# Altium schematic sheet 3V3REG.SchDoc
size B; SheetNumber: 10; SheetTotal: 11
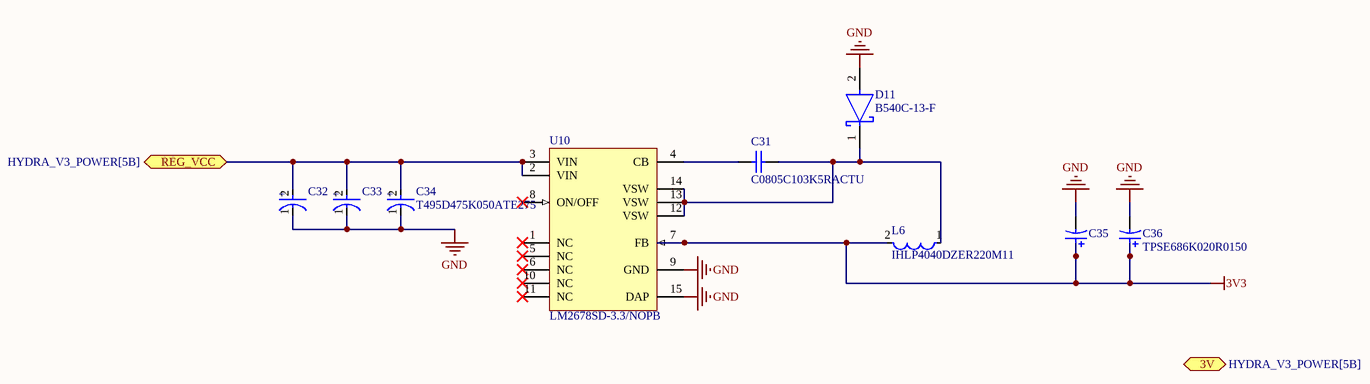
[diagram p0: 3V3REG.SchDoc]

## Parts
C31  C0805C103K5RACTU  [CAPC2013X88X50LL20T25]
C32  (no value)  [FP-T495D475K050ATE275-MFG]
C33  (no value)  [FP-T495D475K050ATE275-MFG]
C34  T495D475K050ATE275  [FP-T495D475K050ATE275-MFG]
C35  (no value)  [CAPMP7344X43-T_V]
C36  TPSE686K020R0150  [CAPMP7344X43-T_V]
D11  B540C-13-F  [FP-SMC-MFG]
L6  IHLP4040DZER220M11  [FP-IHLP-4040DZ-FP_3_124x3-MFG]
U10  LM2678SD-3.3/NOPB  [NHM0014A_V]

## Ports
3V (bidir, see HYDRA_V3_POWER[5B]), REG_VCC (bidir, see HYDRA_V3_POWER[5B])

## Nets
3V3: C35.1 C36.1 L6.2 U10.7(FB)
GND: C32.1(C) C33.1(C) C34.1(C) C35.2 C36.2 D11.2(A) U10.9(GND) U10.15(DAP)
REG_VCC: C32.2(A) C33.2(A) C34.2(A) U10.2(VIN) U10.3(VIN) ; port REG_VCC
NetC31_1: C31.1 U10.4(CB)
NetC31_2: C31.2 D11.1(C) L6.1 U10.12(VSW) U10.13(VSW) U10.14(VSW)

Not connected (* = marked no-connect by the designer): U10 1(NC)* 5(NC)* 6(NC)* 8(ON/OFF)* 10(NC)* 11(NC)*

## Notes on the sheet
- (in symbol CMP-03017-000055-1) +

## Library data of the parts
C31 = CMP-2007-00266-1: Manufacturer: Kemet; Part Number: C0805C103K5RACTU
C32-C34 = CMP-03017-000055-1: CAP TANT 4.7UF 10% 50V 2917; Life (Hours): 2000Hour; Polarity: Polar; Dissipation Factor: 6%; ESR (Equivalent Series Resistance): 275mR; Construction: Flat; Features: General Purpose; RoHS Compliant: Yes; Lead Free: Lead Free; Case Code (Imperial): 2917; Height - Seated (Max): 0.122inch; Termination: SMD/SMT; Number of Pins: 2; Packaging: Tape and Reel; Voltage Rating (DC): 50V; Case Code (Metric): 7343; Mount: Surface Mount; Radiation Hardening: No; Width: 0.169inch; Package Quantity: 1; Depth: 4.3mm; Voltage Rating: 50V; Tolerance: 10%; Max Operating Temperature: 125°C; Min Operating Temperature: -55°C; Length: 7.3mm; Capacitance: 4.7uF; REACH SVHC: No SVHC; Height: 3.1mm; Series: T495; Case/Package: 2917
C35 C36 = CMP-2000-07314-1: Low ESR, 68 uF, 20 V, +/- 10%, -55 to 125 degC, 2-Pin SMD, RoHS, Tape and Reel; Manufacturer: AVX; Wire Form: NotRequired; Product Diameter (mm): NotRequiredmm; Product Height (mm): 4.1mm; Rad Hardened: No; Voltage: 20VDC; DF: 6%; Product Depth (mm): 4.3mm; DCL: 13.6uA; Product Length (mm): 7.3mm; Capacitance: 68000000pF; DELETED: Compliant; ESR: 0.15ohm; Polarity: Polar; Case Style: Molded; Insulation: NotRequired; Construction: SMTChip; Mounting Technology: SurfaceMount; Failure Rate: NotRequired; Length W/Weld (max): NotRequiredmm; Package Reference: CAPMP7344X43-T; Seal: NotRequired; Tolerance (+ or -): 10%; Operating Temp Range: -55Cto125C; Seated Plane Height: NotRequiredmm; Package URL: http://www.avx.com/download/software/literature/AVX-Footprint-Library.pdf; Lead Spacing (nom): NotRequiredmm; Mounting Style: SurfaceMount; Case Code: E; Package Description: 2-Pin Surface Mount Device, Body 7.3 x 4.35 mm; Manufacturer URL: http://www.avx.com/; Package / Case: 7343-43; Packaging: TapeandReel; Datasheet Version: 01/2017; Length W/Weld: NotRequiredmm; Datasheet URL: http://datasheets.avx.com/TPS.pdf
D11 = CMP-2000-05097-3: DIODE SCHOTTKY 40V 5A SMC; Manufacturer: Diodes Inc.; Automotive Grade: NA; Peak Reverse Current: 0.5mA; Value: 300pF; Max Junction Temp: +150°C; Max Surge Forward Current: 100A; Standoff Height: 0.1mm; Digikey Description: DIODE SCHOTTKY 40V 5A SMC; Temperature Range Low: -55°C; Manufacturer Part Number: B540C-13-F; Octopart: https://octopart.com/b540c-13-f-diodes+inc.-325873; Lead Free: Yes; Reverse Voltage: 40V; RoHS: TRUE; Category: Diode; Mouser Description: Diode: Schottky rectifying; SMD; 40V; 5A; SMC; Package: reel, tape; ComponentLink2Description: Datasheet; Temperature Range High: +150°C; Automotive: No; Footprint Url: https://www.diodes.com/assets/Package-Files/SMC.pdf; Device Class L3: Schottky Diodes; Height: 2.5mm; Forward Current: 5A; Temperature: -55°C to +150°C; Package: SMC; ComponentLink2URL: https://www.diodes.com/assets/Datasheets/ds13012.pdf; Device Class L2: Diodes; Max Repetitive Reverse Voltage: 40V; Device Class L1: Discrete Semiconductors; Capacitance: 300pF
L6 = CMP-02424-000785-1: Commercial Inductors, Low DCR Series 22uH 5A 66mΩ 20%; Shielding: Shielded; Max DC Current: 4.5A; Test Frequency: 100kHz; DC Resistance (DCR): 66mR; Self Resonant Frequency: 1MHz; Core Material: Metal; Series: IHLP-4040DZ-11; Min Operating Temperature: -55°C; Rated Current-Max: 5A; Current Rating: 5A; Military Standard: Not; Depth: 10.3mm; Height - Seated (Max): 0.157inch; Contact Plating: Tin; Termination: SMD/SMT; Length: 0.43inch; Package Quantity: 1; Width: 0.405inch; Inductance Tolerance: 20%; Tolerance: 20%; Height: 4mm; RMS Current (Irms): 5A; Saturation Current: 4.5A; Inductance: 22uH; Mount: Surface Mount; Max Operating Temperature: 125°C; Case/Package: 4040; Packaging: Tape and Reel; Radiation Hardening: No; RoHS Compliant: Yes; Lead Free: Lead Free
U10 = CMP-0069-01078-3: SIMPLE SWITCHER® High Efficiency 5A Step-Down Voltage Regulator, 14-pin LLP, Pb-Free; Manufacturer: Texas Instruments; PackageTopMarking: NS*UZXYTT*S0003CB; PowerWise: N; CompType: Switcher; PackageDescription: LLP, Plastic, Dual, 6 x 5 x 1mm Body, 14 Lead, 0.8mm Pitch, No Pullback; PackageReference: NHM0014A; PinCount: 14; ComponentLink1URL: http://www.ti.com/general/docs/lit/getliterature.tsp?genericPartNumber=LM2678&fileType=pdf; RoHS: Y; ComponentLink1Description: Datasheet URL